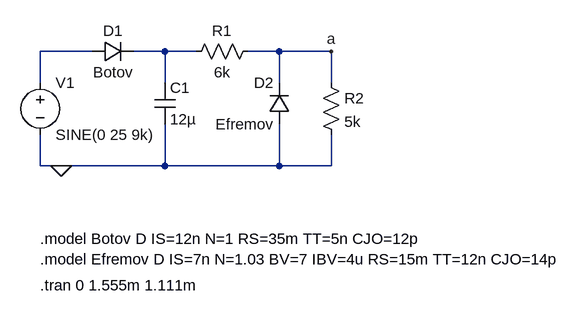
[diagram p0: schematic task_3.asc]
task_3.asc, the LTspice schematic file:
Version 4
SHEET 1 964 680
WIRE 112 96 32 96
WIRE 224 96 176 96
WIRE 272 96 224 96
WIRE 400 96 352 96
WIRE 480 96 400 96
WIRE 32 144 32 96
WIRE 224 144 224 96
WIRE 400 144 400 96
WIRE 480 144 480 96
WIRE 32 272 32 224
WIRE 64 272 32 272
WIRE 224 272 224 208
WIRE 224 272 64 272
WIRE 400 272 400 208
WIRE 400 272 224 272
WIRE 480 272 480 224
WIRE 480 272 400 272
FLAG 64 272 0
FLAG 480 96 a
SYMBOL voltage 32 128 R0
WINDOW 123 0 0 Left 2
WINDOW 39 0 0 Left 2
SYMATTR InstName V1
SYMATTR Value SINE(0 25 9k)
SYMBOL diode 112 112 R270
WINDOW 0 32 32 VTop 2
WINDOW 3 0 32 VBottom 2
SYMATTR InstName D1
SYMATTR Value Botov
SYMBOL cap 208 144 R0
SYMATTR InstName C1
SYMATTR Value 12µ
SYMBOL res 368 80 R90
WINDOW 0 0 56 VBottom 2
WINDOW 3 32 56 VTop 2
SYMATTR InstName R1
SYMATTR Value 6k
SYMBOL diode 416 208 R180
WINDOW 0 24 64 Left 2
WINDOW 3 24 0 Left 2
SYMATTR InstName D2
SYMATTR Value Efremov
SYMBOL res 464 128 R0
SYMATTR InstName R2
SYMATTR Value 5k
TEXT 32 416 Left 2 !.model Efremov D IS=7n N=1.03 BV=7 IBV=4u RS=15m TT=12n CJO=14p
TEXT 32 384 Left 2 !.model Botov D IS=12n N=1 RS=35m TT=5n CJO=12p
TEXT 32 456 Left 2 !.tran 0 1.555m 1.111m

The netlist it stands for:
* task_3.asc
V1 N001 0 SINE(0 25 9k)
D1 N001 N002 Botov
C1 N002 0 12µ
R1 a N002 6k
D2 0 a Efremov
R2 a 0 5k
.model D D
.lib standard.dio
.model Efremov D IS=7n N=1.03 BV=7 IBV=4u RS=15m TT=12n CJO=14p
.model Botov D IS=12n N=1 RS=35m TT=5n CJO=12p
.tran 0 1.555m 1.111m
.backanno
.end

* Results of the author's LTspice run, read from the files saved beside the schematic
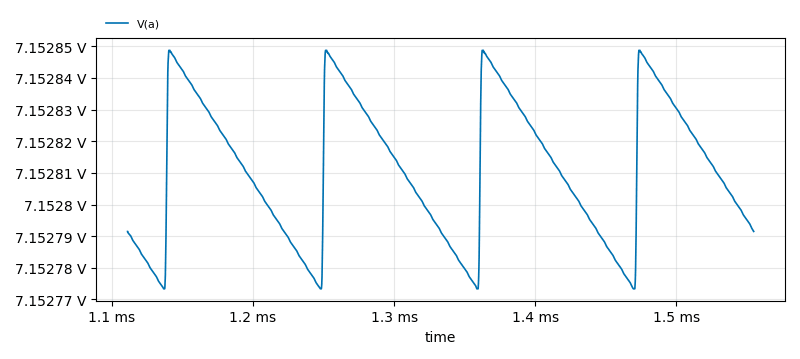
[diagram p1: Transient Analysis of task_3.asc, plotted from the saved traces]
* Transient Analysis, 1 run:
*   V(a): min 7.153 V, max 7.153 V, average 7.153 V, rms 7.153 V, last 7.153 V